# Altium project PCB_Slave_Traffic_Light.PrjPcb (part 1 of 4)
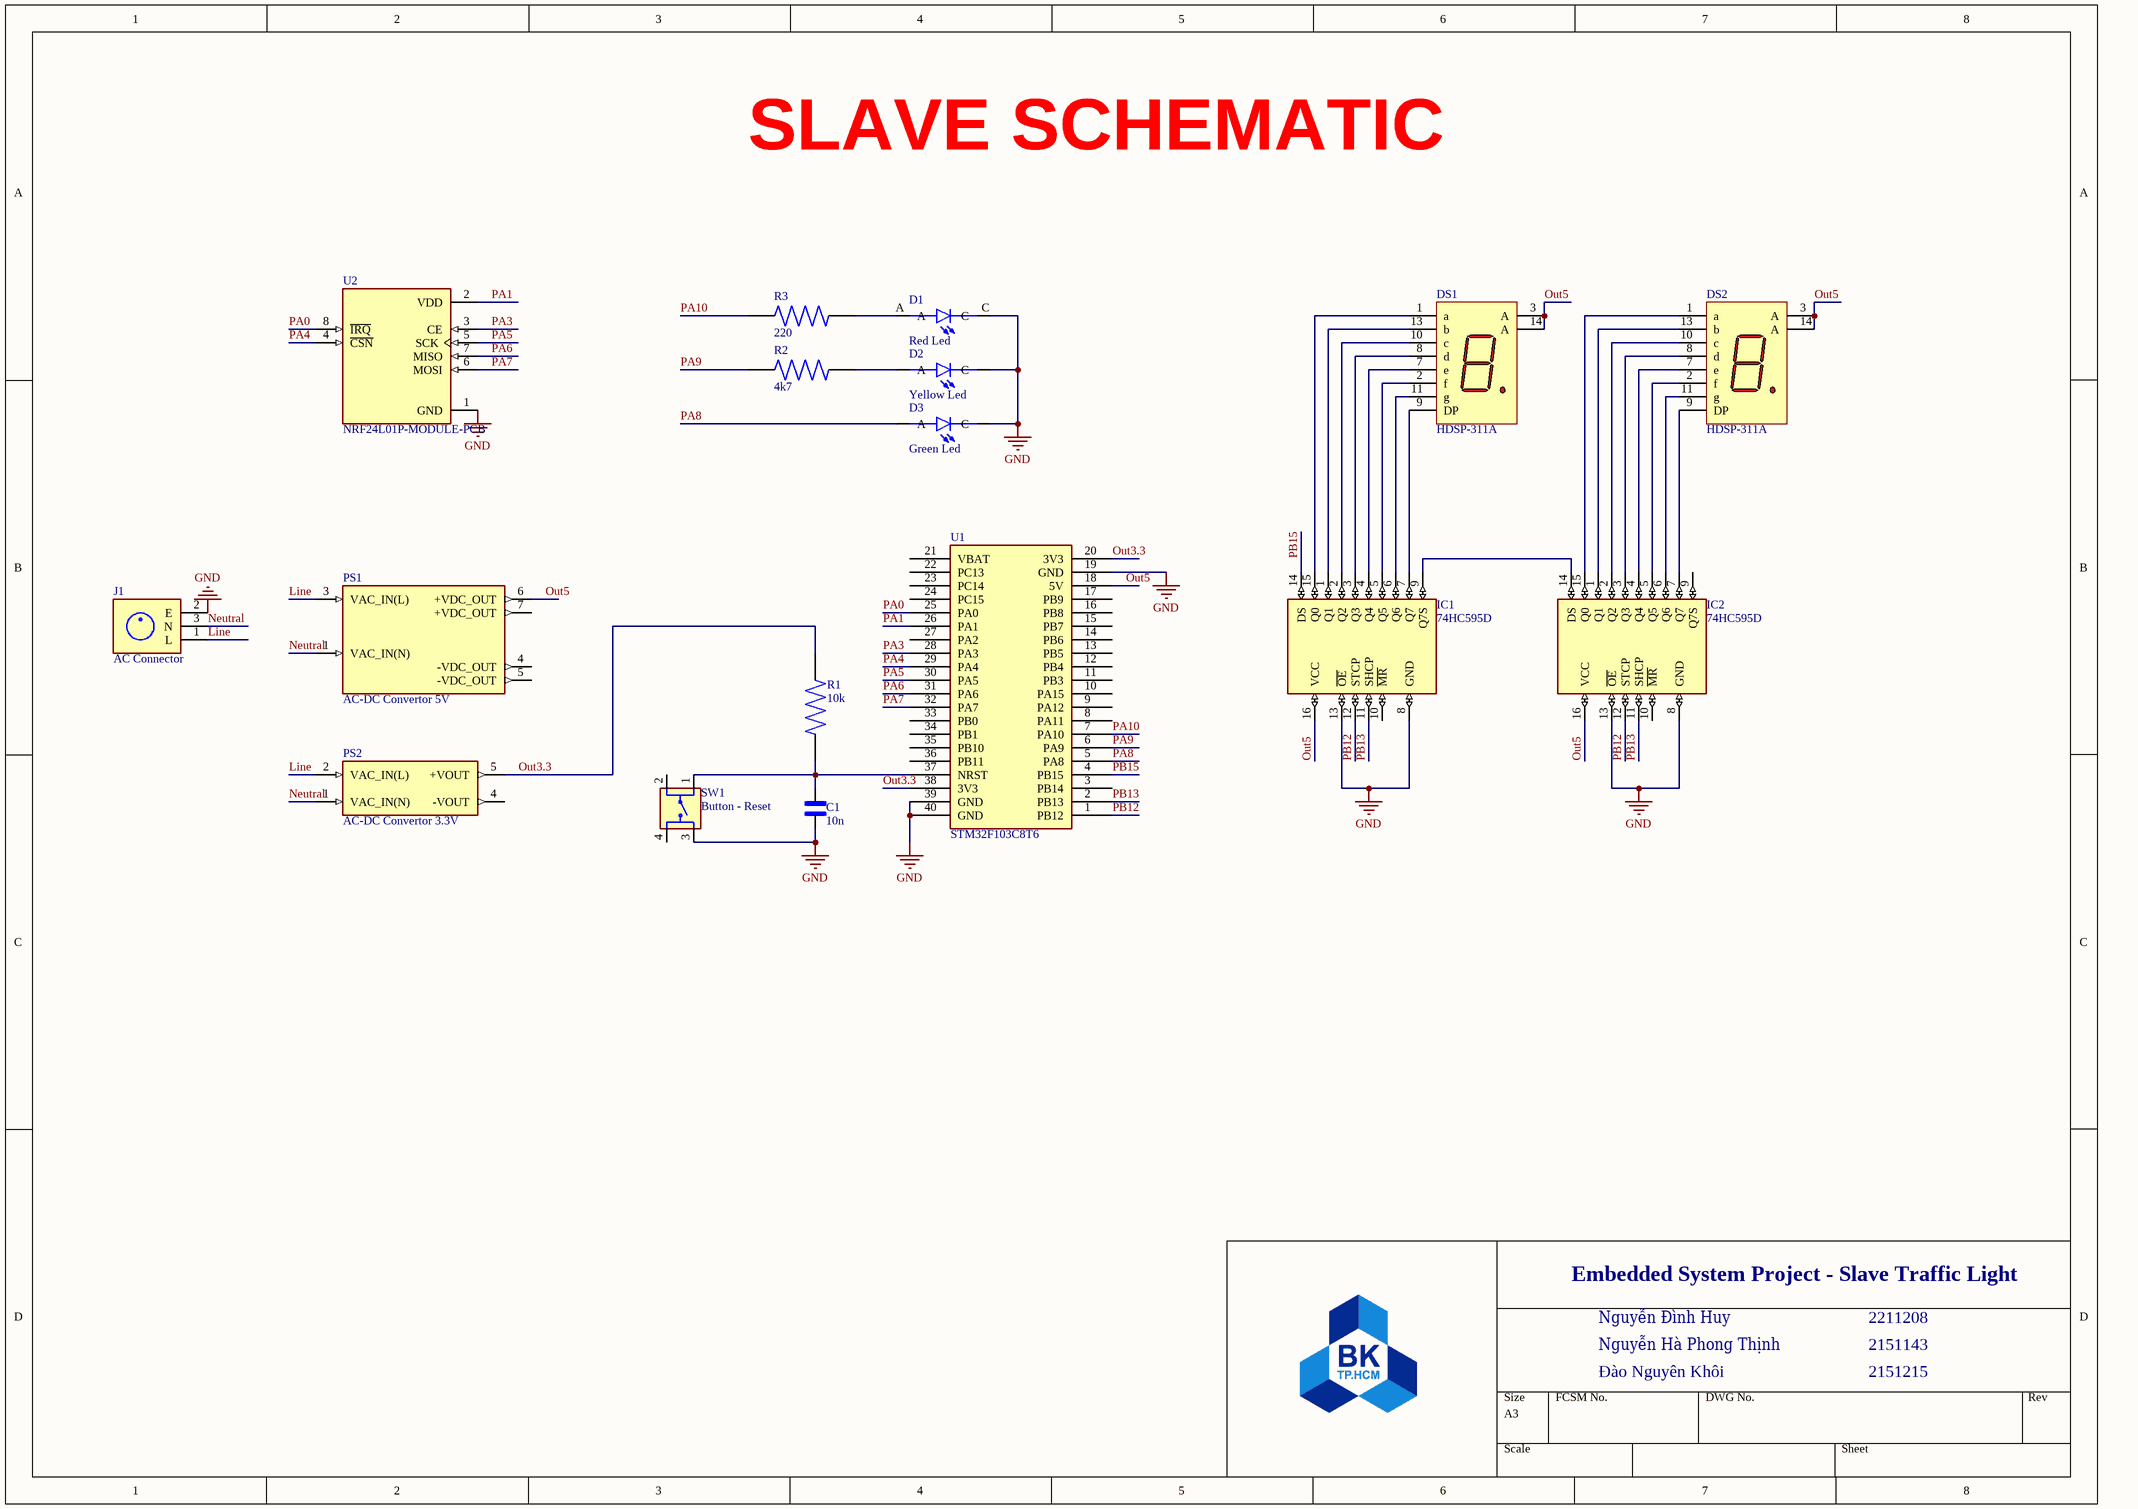
[diagram p0: PCB_Slave_Traffic_Light.SchDoc]
3 sheets, 17 parts. Net scope: global (net labels, ports and power ports of the same name join across sheets).
Board file: PCB_Slave_Traffic_Light.PcbDoc
Sheets:
  PCB_Slave_Traffic_Light.SchDoc
  PCB_Slave_Traffic_Light_BLOCK_DIAGRAM.SchDoc
  PCB_Slave_Traffic_Light_COVER_PAGE.SchDoc

## Sheet PCB_Slave_Traffic_Light.SchDoc
size A3; SheetNumber: 1; SheetTotal: 3

### Parts
C1  10n  [CAPC1005X55N]
D1  Red Led  [LED_WP7113ID]
D2  Yellow Led  [LED_WP7113SYD]
D3  Green Led  [LED_WP7113GD]
DS1  HDSP-311A  [F-10(14)]
DS2  HDSP-311A  [F-10(14)]
IC1  74HC595D  [SOIC127P600X175-16N]
IC2  74HC595D  [SOIC127P600X175-16N]
J1  AC Connector  [QUALTEK_703W-00/52]
PS1  AC-DC Convertor 5V  [CONV_RACM40-05SK/OF/PCB-T]
PS2  AC-DC Convertor 3.3V  [CONV_RAC10-3.3SK/277]
R1  10k  [RESC2012X60N]
R2  4k7  [RESC1608X55N]
R3  220  [RESC6332X120N]
SW1  Button - Reset  [SW_FSM8JH]
U1  STM32F103C8T6  [Stm32 BluePill]
U2  NRF24L01P-MODULE-PCB  [XCVR_NRF24L01P-MODULE-PCB]

### Nets
GND: C1.1 D1.C D2.C D3.C IC1.8(GND) IC1.13(~{OE}) IC2.8(GND) IC2.13(~{OE}) J1.2(E) SW1.3 U1.19(GND) U1.39(GND) U1.40(GND) U2.1(GND)
Line: J1.1(L) PS1.3(VAC_IN(L)) PS2.2(VAC_IN(L))
Neutral: J1.3(N) PS1.1(VAC_IN(N)) PS2.1(VAC_IN(N))
Out3.3: PS2.5(+VOUT) R1.1 U1.20(3V3) U1.38(3V3)
Out5: DS1.3(A) DS1.14(A) DS2.3(A) DS2.14(A) IC1.16(VCC) IC2.16(VCC) PS1.6(+VDC_OUT) U1.18(5V)
PA0: U1.25(PA0) U2.8(~{IRQ})
PA1: U1.26(PA1) U2.2(VDD)
PA3: U1.28(PA3) U2.3(CE)
PA4: U1.29(PA4) U2.4(~{CSN})
PA5: U1.30(PA5) U2.5(SCK)
PA6: U1.31(PA6) U2.7(MISO)
PA7: U1.32(PA7) U2.6(MOSI)
PA8: D3.A U1.5(PA8)
PA9: R2.1 U1.6(PA9)
PA10: R3.1 U1.7(PA10)
PB12: IC1.12(STCP) IC2.12(STCP) U1.1(PB12)
PB13: IC1.11(SHCP) IC2.11(SHCP) U1.2(PB13)
PB15: IC1.14(DS) U1.4(PB15)
NetC1_2: C1.2 R1.2 SW1.1 U1.37(NRST)
NetD1_A: D1.A R3.2
NetD2_A: D2.A R2.2
NetDS1_1: DS1.1(a) IC1.15(Q0)
NetDS1_2: DS1.2(f) IC1.5(Q5)
NetDS1_7: DS1.7(e) IC1.4(Q4)
NetDS1_8: DS1.8(d) IC1.3(Q3)
NetDS1_9: DS1.9(DP) IC1.7(Q7)
NetDS1_10: DS1.10(c) IC1.2(Q2)
NetDS1_11: DS1.11(g) IC1.6(Q6)
NetDS1_13: DS1.13(b) IC1.1(Q1)
NetDS2_1: DS2.1(a) IC2.15(Q0)
NetDS2_2: DS2.2(f) IC2.5(Q5)
NetDS2_7: DS2.7(e) IC2.4(Q4)
NetDS2_8: DS2.8(d) IC2.3(Q3)
NetDS2_9: DS2.9(DP) IC2.7(Q7)
NetDS2_10: DS2.10(c) IC2.2(Q2)
NetDS2_11: DS2.11(g) IC2.6(Q6)
NetDS2_13: DS2.13(b) IC2.1(Q1)
NetIC1_9: IC1.9(Q7S) IC2.14(DS)

Not connected (* = marked no-connect by the designer): IC1 10(~{MR}); IC2 9(Q7S) 10(~{MR}); PS1 4(-VDC_OUT) 5(-VDC_OUT) 7(+VDC_OUT); PS2 4(-VOUT); SW1 2 4; U1 3(PB14) 8(PA11) 9(PA12) 10(PA15) 11(PB3) 12(PB4) 13(PB5) 14(PB6) 15(PB7) 16(PB8) 17(PB9) 21(VBAT) 22(PC13) 23(PC14) 24(PC15) 27(PA2) 33(PB0) 34(PB1) 35(PB10) 36(PB11)

### Notes on the sheet
- SLAVE SCHEMATIC
- Embedded System Project - Slave Traffic Light
- Nguyễn Đình Huy
- 2211208
- Nguyễn Hà Phong Thịnh
- Đào Nguyên Khôi
- 2151143
- 2151215

### Library data of the parts
C1 = GCM155R11H103KA40D: Multilayer Ceramic Capacitors MLCC - SMD/SMT; MF: Murata; SnapEDA_Link: https://www.snapeda.com/parts/GCM155R11H103KA40D/Murata/view-part/?ref=snap; Package: 1005 Taiyo Yuden; Value: *; MP: GCM155R11H103KA40D; Check_prices: https://www.snapeda.com/parts/GCM155R11H103KA40D/Murata/view-part/?ref=eda
D1 = WP7113ID: Red 617nm LED Indication - Discrete 2V Radial; MF: Kingbright; Price: None; MP: WP7113ID; Package: Radial Kingbright; Check_prices: https://www.snapeda.com/parts/WP7113ID/Kingbright/view-part/?ref=eda; Purchase-URL: https://pricing.snapeda.com/search/part/WP7113ID/?ref=eda; Availability: In Stock; Value: *; SnapEDA_Link: https://www.snapeda.com/parts/WP7113ID/Kingbright/view-part/?ref=snap
D2 = WP7113SYD: Yellow 590nm LED Indication - Discrete 2V Radial; MF: Kingbright; SnapEDA_Link: https://www.snapeda.com/parts/WP7113SYD/Kingbright/view-part/?ref=snap; Package: Radial Kingbright; Value: *; MP: WP7113SYD; Check_prices: https://www.snapeda.com/parts/WP7113SYD/Kingbright/view-part/?ref=eda
D3 = WP7113GD: Green 568nm LED Indication - Discrete 2.2V Radial; MF: Kingbright; SnapEDA_Link: https://www.snapeda.com/parts/WP7113GD/Kingbright/view-part/?ref=snap; Package: Radial Kingbright; Value: *; MP: WP7113GD; Check_prices: https://www.snapeda.com/parts/WP7113GD/Kingbright/view-part/?ref=eda
DS1 DS2 = HDSP-311A: 10.16 mm Single Digit General Purpose AlGaAs Red 7-Segment Display: CA, RH DP; LuminousIntensity: 3200 ucd (Minimum).; Note: No pins are present in positions 4, 5, 6 and 12.; Published: 26-May-2004; LatestRevisionDate: 11-Oct-2004; LatestRevisionNote: Display outline superimposed on PCB Footprint.; DatasheetDocument: 20-Aug-2001; PackageDocument: 20-Aug-2001; PackageReference: F-10(14); Publisher: Altium Limited; LED_Colour: AlGaAs Red; ComponentLink1Description: Manufacturer Link; ComponentLink1URL: http://www.agilent.com/; ComponentLink2Description: Datasheet; ComponentLink2URL: http://cp.literature.agilent.com/litweb/pdf/5988-2969EN.pdf
IC1 IC2 = 74HC595D: Shift Register Single 8-Bit Serial to Serial/Parallel 16-Pin SOIC T/R; MF: NXP Semiconductors; SnapEDA_Link: https://www.snapeda.com/parts/74HC595D/NXP+Semiconductors/view-part/?ref=snap; Package: SOIC-16 ON Semiconductor; Value: *; MP: 74HC595D; Check_prices: https://www.snapeda.com/parts/74HC595D/NXP+Semiconductors/view-part/?ref=eda
J1 = 703W-00/52: Power Entry Connector Receptacle, Male Blades IEC 320-C14 Panel Mount, Flange; Through Hole, Right Angle; MF: Qualtek; Availability: Unavailable; MP: 703W-00/52; Package: None; SnapEDA_Link: https://www.snapeda.com/parts/703W-00/52/Qualtek/view-part/46399/?ref=snap; Value: *; Price: None
PS1 = RACM40-05SK/OF/PCB-T: Open Frame AC DC Converters 1 Uitgang 5V - - - 6A 80 ~ 264 VAC, 120 ~ 370 VDC Input; MF: Recom Power; SnapEDA_Link: https://www.snapeda.com/parts/RACM40-05SK/OF/PCB-T/Recom+Power/view-part/?ref=snap; Package: DIP-7 Recom Power; Value: *; MP: RACM40-05SK/OF/PCB-T; Check_prices: https://www.snapeda.com/parts/RACM40-05SK/OF/PCB-T/Recom+Power/view-part/?ref=eda
PS2 = RAC10-3.3SK/277: 10W AC/DC-Converter 'POWERLINE' 2x1 4kV reg; MF: Recom Power; Mouser-Purchase-URL: https://snapeda.com/shop?store=Mouser&id=2246573; Price: None; Package: DIP-4 Recom Power; Arrow_Electronics-Purchase-URL: https://snapeda.com/shop?store=Arrow+Electronics&id=2246573; Value: *; MP: RAC10-3.3SK/277; DigiKey-Purchase-URL: https://snapeda.com/shop?store=DigiKey&id=2246573; SnapEDA_Link: https://www.snapeda.com/parts/RAC10-3.3SK/277/Recom%20Power/view-part/2246573/?ref=snap; Availability: Warning
R1 = RC0805FR-0710KL: 10 kOhms Â±1% 0.125W, 1/8W Chip Resistor 0805 (2012 Metric) Moisture Resistant Thick Film; MF: Yageo; Value: *; SnapEDA_Link: https://www.snapeda.com/parts/RC0805FR-0710KL/Yageo/view-part/?ref=snap; Purchase-URL: https://pricing.snapeda.com/search/part/RC0805FR-0710KL/?ref=eda; Availability: In Stock; Price: None; Package: 2012 Rohm Semiconductor; Check_prices: https://www.snapeda.com/parts/RC0805FR-0710KL/Yageo/view-part/?ref=eda; MP: RC0805FR-0710KL
R2 = CRG0603F4K7: Resistor, Thick Film, Res 4.7 Kilohms, Pwr-Rtg 0.1 W, Tol 1%, SMT, 0603 | TE Connectivity CRG0603F4K7; Power_Rating: .1 W; Resistance: 4.7K; Voltage_Rating: 50 V; SnapEDA_Link: https://www.snapeda.com/parts/CRG0603F4K7/TE+Connectivity+Passive+Product/view-part/?ref=snap; Package: 0603; Value: *; MF: TE Connectivity; MP: CRG0603F4K7; EU_RoHS_Compliance: Compliant with Exemptions; Tolerance: 1%; Check_prices: https://www.snapeda.com/parts/CRG0603F4K7/TE+Connectivity+Passive+Product/view-part/?ref=eda
R3 = 3522220RFT: 220 Ohms Â±1% 3W Chip Resistor 2512 (6432 Metric) Automotive AEC-Q200 Thick Film; MF: TE Connectivity; Tolerance: 1%; Power_Rating: 3 W; SnapEDA_Link: https://www.snapeda.com/parts/3522220RFT/TE+Connectivity/view-part/?ref=snap; Package: 2512; Resistance: 220; Value: *; MP: 3522220RFT; EU_RoHS_Compliance: Compliant with Exemptions; Check_prices: https://www.snapeda.com/parts/3522220RFT/TE+Connectivity/view-part/?ref=eda
SW1 = FSM8JH: Tactile Switch SPST-NO Top Actuated Through Hole; MF: TE Connectivity; Check_prices: https://www.snapeda.com/parts/FSM8JH/TE+Connectivity+ALCOSWITCH+Switches/view-part/?ref=eda; Value: *; Availability: In Stock; MP: FSM8JH; Price: None; Package: None; SnapEDA_Link: https://www.snapeda.com/parts/FSM8JH/TE+Connectivity+ALCOSWITCH+Switches/view-part/?ref=snap
U1 = BluePill: Designed By @Alixahedi
U2 = NRF24L01P-MODULE-PCB: - Transceiver For Use With nRF24L01+; MF: Nordic Semiconductor; Package: None; MP: NRF24L01P-MODULE-PCB; Value: *; Availability: Bad; Price: None; SnapEDA_Link: https://www.snapeda.com/parts/NRF24L01P-MODULE-PCB/Nordic%20Semiconductor%20ASA/view-part/230534/?ref=snap; Mouser-Purchase-URL: https://snapeda.com/shop?store=Mouser&id=230534

## Sheet PCB_Slave_Traffic_Light_BLOCK_DIAGRAM.SchDoc
size A3; SheetNumber: 2; SheetTotal: 3
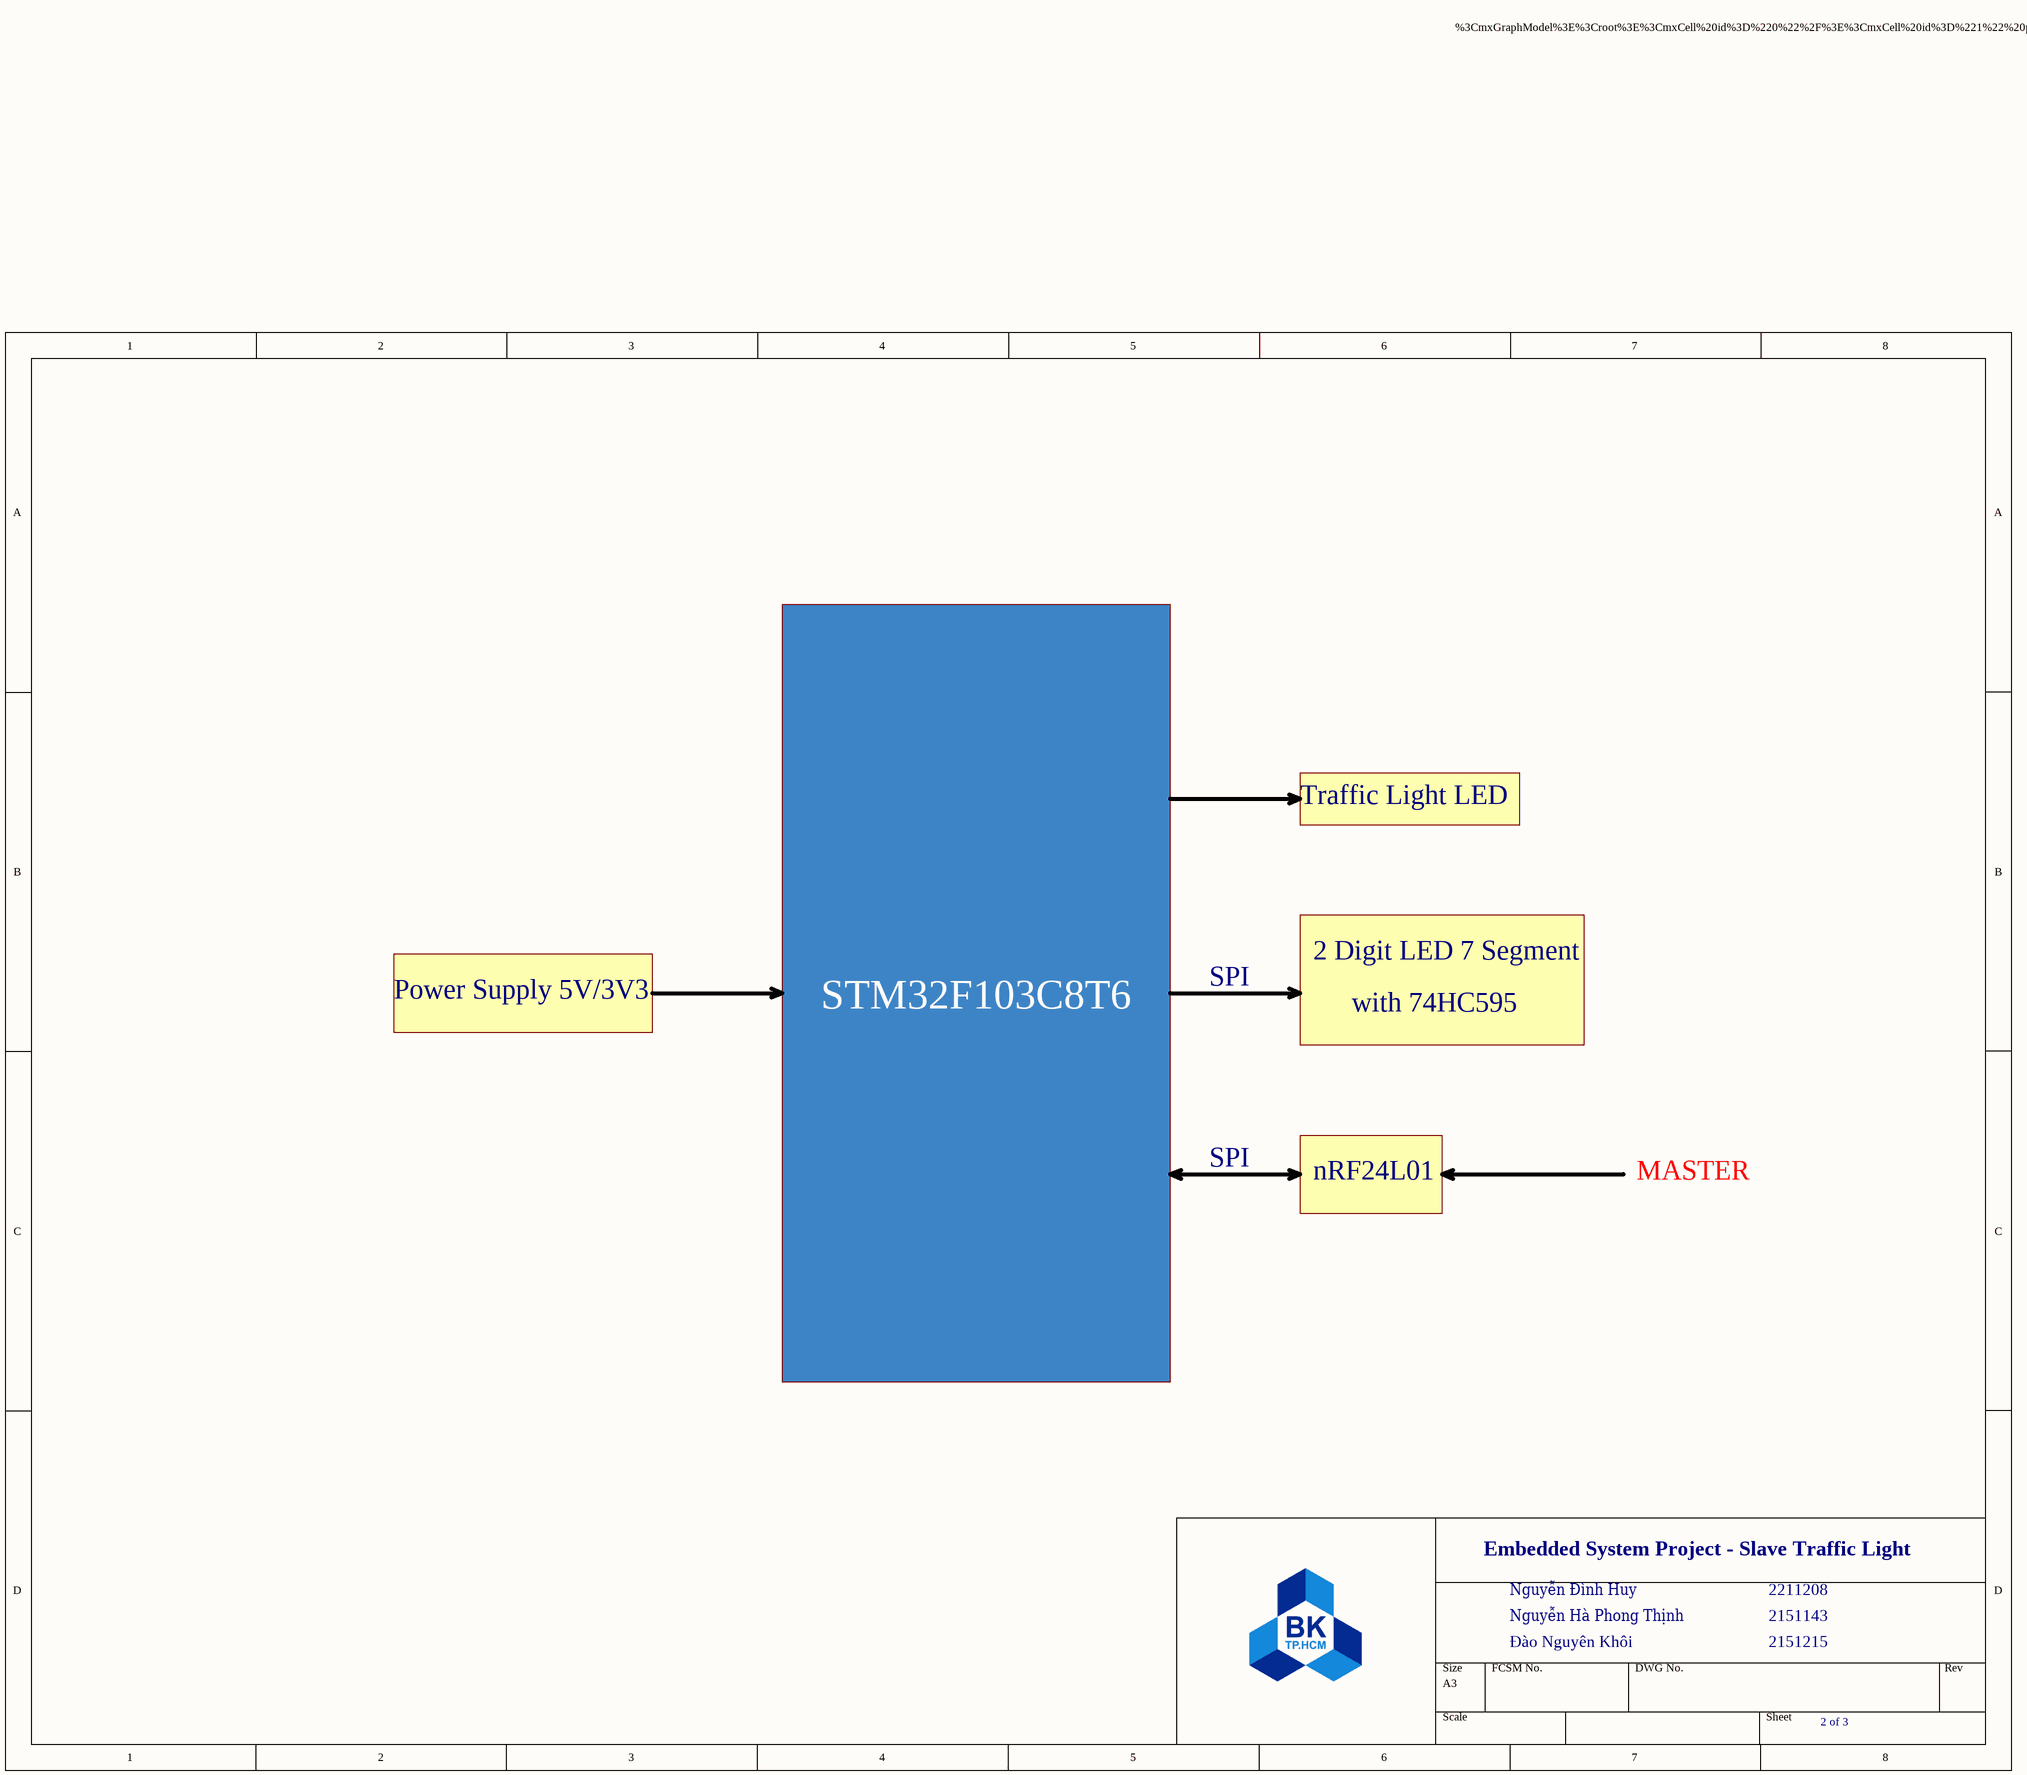
[diagram p1: PCB_Slave_Traffic_Light_BLOCK_DIAGRAM.SchDoc]
### Notes on the sheet